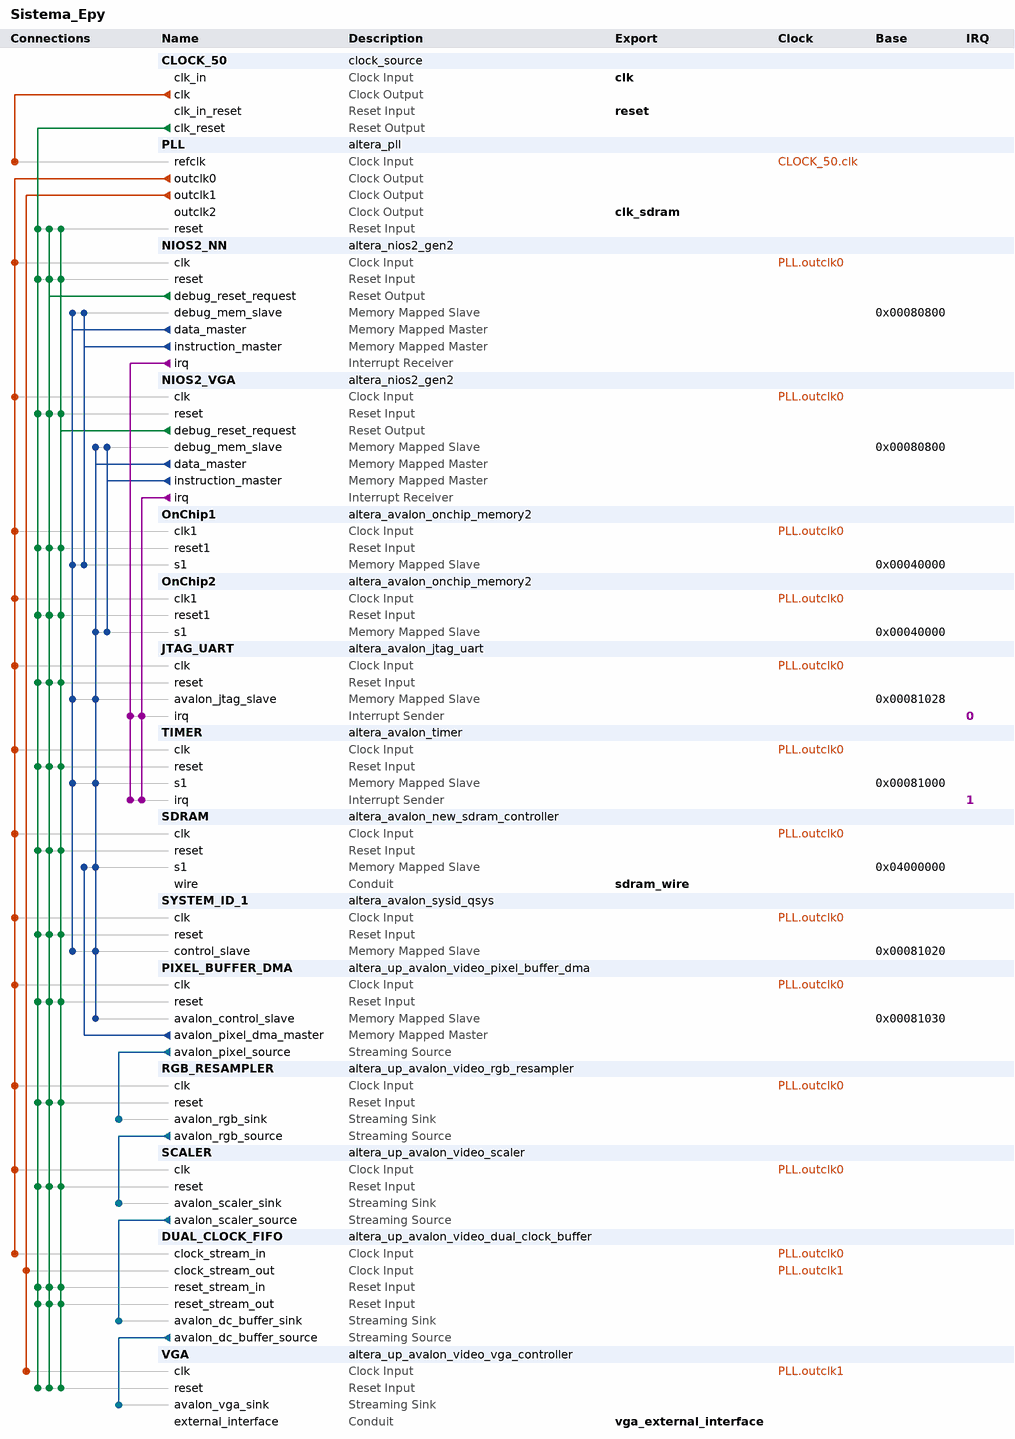
[diagram p0: system contents]
# Platform Designer (Qsys) system Sistema_Epy, Cyclone V 5CSXFC6D6F31C6
# Parameters at their usual value, and those the tool derives, are not listed.
package require -exact qsys 16.1
create_system Sistema_Epy
set_project_property DEVICE_FAMILY {Cyclone V}
set_project_property DEVICE 5CSXFC6D6F31C6

add_instance CLOCK_50 clock_source 16.1
set_instance_parameter_value CLOCK_50 clockFrequency 50000000

add_instance PLL altera_pll 16.1
set_instance_parameter_value PLL gui_device_speed_grade 2
set_instance_parameter_value PLL gui_number_of_clocks 3
set_instance_parameter_value PLL gui_operation_mode direct
set_instance_parameter_value PLL gui_output_clock_frequency0 100.0
set_instance_parameter_value PLL gui_output_clock_frequency1 25.0
set_instance_parameter_value PLL gui_output_clock_frequency2 100.0
set_instance_parameter_value PLL gui_phase_shift2 -3000
set_instance_parameter_value PLL gui_pll_mode {Integer-N PLL}
set_instance_parameter_value PLL gui_reference_clock_frequency 50.0
set_instance_parameter_value PLL gui_use_locked false

add_instance NIOS2_NN altera_nios2_gen2 16.1
set_instance_parameter_value NIOS2_NN dcache_size 2048
set_instance_parameter_value NIOS2_NN exceptionSlave OnChip1.s1
set_instance_parameter_value NIOS2_NN icache_size 4096
set_instance_parameter_value NIOS2_NN impl Tiny
set_instance_parameter_value NIOS2_NN resetSlave OnChip1.s1

add_instance NIOS2_VGA altera_nios2_gen2 16.1
set_instance_parameter_value NIOS2_VGA dcache_size 2048
set_instance_parameter_value NIOS2_VGA exceptionSlave OnChip2.s1
set_instance_parameter_value NIOS2_VGA icache_size 4096
set_instance_parameter_value NIOS2_VGA impl Fast
set_instance_parameter_value NIOS2_VGA resetSlave OnChip2.s1

add_instance OnChip1 altera_avalon_onchip_memory2 16.1
set_instance_parameter_value OnChip1 dataWidth 32
set_instance_parameter_value OnChip1 dualPort false
set_instance_parameter_value OnChip1 initMemContent true
set_instance_parameter_value OnChip1 initializationFileName onchip_mem.hex
set_instance_parameter_value OnChip1 memorySize 240000

add_instance OnChip2 altera_avalon_onchip_memory2 16.1
set_instance_parameter_value OnChip2 dataWidth 32
set_instance_parameter_value OnChip2 dualPort false
set_instance_parameter_value OnChip2 initMemContent true
set_instance_parameter_value OnChip2 initializationFileName onchip_mem.hex
set_instance_parameter_value OnChip2 memorySize 240000

add_instance JTAG_UART altera_avalon_jtag_uart 16.1
set_instance_parameter_value JTAG_UART simInteractiveOptions NO_INTERACTIVE_WINDOWS

add_instance TIMER altera_avalon_timer 16.1
set_instance_parameter_value TIMER period 1
set_instance_parameter_value TIMER periodUnits MSEC

add_instance SDRAM altera_avalon_new_sdram_controller 16.1
set_instance_parameter_value SDRAM TAC 5.5
set_instance_parameter_value SDRAM TRCD 20.0
set_instance_parameter_value SDRAM TRP 20.0
set_instance_parameter_value SDRAM casLatency 3
set_instance_parameter_value SDRAM columnWidth 10
set_instance_parameter_value SDRAM dataWidth 16
set_instance_parameter_value SDRAM generateSimulationModel false
set_instance_parameter_value SDRAM model single_Micron_MT48LC4M32B2_7_chip
set_instance_parameter_value SDRAM numberOfBanks 4
set_instance_parameter_value SDRAM numberOfChipSelects 1
set_instance_parameter_value SDRAM powerUpDelay 100.0
set_instance_parameter_value SDRAM refreshPeriod 15.625
set_instance_parameter_value SDRAM rowWidth 13

add_instance SYSTEM_ID_1 altera_avalon_sysid_qsys 16.1
set_instance_parameter_value SYSTEM_ID_1 id 0

add_instance PIXEL_BUFFER_DMA altera_up_avalon_video_pixel_buffer_dma 16.1
set_instance_parameter_value PIXEL_BUFFER_DMA addr_mode X-Y
set_instance_parameter_value PIXEL_BUFFER_DMA back_start_address 0
set_instance_parameter_value PIXEL_BUFFER_DMA color_space {16-bit RGB}
set_instance_parameter_value PIXEL_BUFFER_DMA image_height 240
set_instance_parameter_value PIXEL_BUFFER_DMA image_width 320
set_instance_parameter_value PIXEL_BUFFER_DMA start_address 0

add_instance RGB_RESAMPLER altera_up_avalon_video_rgb_resampler 16.1
set_instance_parameter_value RGB_RESAMPLER alpha 1023
set_instance_parameter_value RGB_RESAMPLER input_type {16-bit RGB}
set_instance_parameter_value RGB_RESAMPLER output_type {30-bit RGB}

add_instance SCALER altera_up_avalon_video_scaler 16.1
set_instance_parameter_value SCALER color_bits 10
set_instance_parameter_value SCALER color_planes 3
set_instance_parameter_value SCALER height_scaling 2
set_instance_parameter_value SCALER width_in 320
set_instance_parameter_value SCALER width_scaling 2

add_instance DUAL_CLOCK_FIFO altera_up_avalon_video_dual_clock_buffer 16.1
set_instance_parameter_value DUAL_CLOCK_FIFO color_bits 10

add_instance VGA altera_up_avalon_video_vga_controller 16.1
set_instance_parameter_value VGA board DE1-SoC
set_instance_parameter_value VGA resolution {VGA 640x480}

# connections
add_connection CLOCK_50.clk PLL.refclk clock
add_connection PLL.outclk0 DUAL_CLOCK_FIFO.clock_stream_in clock
add_connection PLL.outclk0 JTAG_UART.clk clock
add_connection PLL.outclk0 NIOS2_NN.clk clock
add_connection PLL.outclk0 NIOS2_VGA.clk clock
add_connection PLL.outclk0 OnChip1.clk1 clock
add_connection PLL.outclk0 OnChip2.clk1 clock
add_connection PLL.outclk0 PIXEL_BUFFER_DMA.clk clock
add_connection PLL.outclk0 RGB_RESAMPLER.clk clock
add_connection PLL.outclk0 SCALER.clk clock
add_connection PLL.outclk0 SDRAM.clk clock
add_connection PLL.outclk0 SYSTEM_ID_1.clk clock
add_connection PLL.outclk0 TIMER.clk clock
add_connection PLL.outclk1 DUAL_CLOCK_FIFO.clock_stream_out clock
add_connection PLL.outclk1 VGA.clk clock
add_connection CLOCK_50.clk_reset DUAL_CLOCK_FIFO.reset_stream_in reset
add_connection CLOCK_50.clk_reset DUAL_CLOCK_FIFO.reset_stream_out reset
add_connection CLOCK_50.clk_reset JTAG_UART.reset reset
add_connection CLOCK_50.clk_reset NIOS2_NN.reset reset
add_connection CLOCK_50.clk_reset NIOS2_VGA.reset reset
add_connection CLOCK_50.clk_reset OnChip1.reset1 reset
add_connection CLOCK_50.clk_reset OnChip2.reset1 reset
add_connection CLOCK_50.clk_reset PIXEL_BUFFER_DMA.reset reset
add_connection CLOCK_50.clk_reset PLL.reset reset
add_connection CLOCK_50.clk_reset RGB_RESAMPLER.reset reset
add_connection CLOCK_50.clk_reset SCALER.reset reset
add_connection CLOCK_50.clk_reset SDRAM.reset reset
add_connection CLOCK_50.clk_reset SYSTEM_ID_1.reset reset
add_connection CLOCK_50.clk_reset TIMER.reset reset
add_connection CLOCK_50.clk_reset VGA.reset reset
add_connection NIOS2_NN.debug_reset_request DUAL_CLOCK_FIFO.reset_stream_in reset
add_connection NIOS2_NN.debug_reset_request DUAL_CLOCK_FIFO.reset_stream_out reset
add_connection NIOS2_NN.debug_reset_request JTAG_UART.reset reset
add_connection NIOS2_NN.debug_reset_request NIOS2_NN.reset reset
add_connection NIOS2_NN.debug_reset_request NIOS2_VGA.reset reset
add_connection NIOS2_NN.debug_reset_request OnChip1.reset1 reset
add_connection NIOS2_NN.debug_reset_request OnChip2.reset1 reset
add_connection NIOS2_NN.debug_reset_request PIXEL_BUFFER_DMA.reset reset
add_connection NIOS2_NN.debug_reset_request PLL.reset reset
add_connection NIOS2_NN.debug_reset_request RGB_RESAMPLER.reset reset
add_connection NIOS2_NN.debug_reset_request SCALER.reset reset
add_connection NIOS2_NN.debug_reset_request SDRAM.reset reset
add_connection NIOS2_NN.debug_reset_request SYSTEM_ID_1.reset reset
add_connection NIOS2_NN.debug_reset_request TIMER.reset reset
add_connection NIOS2_NN.debug_reset_request VGA.reset reset
add_connection NIOS2_VGA.debug_reset_request DUAL_CLOCK_FIFO.reset_stream_in reset
add_connection NIOS2_VGA.debug_reset_request DUAL_CLOCK_FIFO.reset_stream_out reset
add_connection NIOS2_VGA.debug_reset_request JTAG_UART.reset reset
add_connection NIOS2_VGA.debug_reset_request NIOS2_NN.reset reset
add_connection NIOS2_VGA.debug_reset_request NIOS2_VGA.reset reset
add_connection NIOS2_VGA.debug_reset_request OnChip1.reset1 reset
add_connection NIOS2_VGA.debug_reset_request OnChip2.reset1 reset
add_connection NIOS2_VGA.debug_reset_request PIXEL_BUFFER_DMA.reset reset
add_connection NIOS2_VGA.debug_reset_request PLL.reset reset
add_connection NIOS2_VGA.debug_reset_request RGB_RESAMPLER.reset reset
add_connection NIOS2_VGA.debug_reset_request SCALER.reset reset
add_connection NIOS2_VGA.debug_reset_request SDRAM.reset reset
add_connection NIOS2_VGA.debug_reset_request SYSTEM_ID_1.reset reset
add_connection NIOS2_VGA.debug_reset_request TIMER.reset reset
add_connection NIOS2_VGA.debug_reset_request VGA.reset reset
add_connection NIOS2_NN.data_master JTAG_UART.avalon_jtag_slave avalon
set_connection_parameter_value NIOS2_NN.data_master/JTAG_UART.avalon_jtag_slave baseAddress 0x00081028
add_connection NIOS2_NN.data_master NIOS2_NN.debug_mem_slave avalon
set_connection_parameter_value NIOS2_NN.data_master/NIOS2_NN.debug_mem_slave baseAddress 0x00080800
add_connection NIOS2_NN.data_master OnChip1.s1 avalon
set_connection_parameter_value NIOS2_NN.data_master/OnChip1.s1 baseAddress 0x00040000
add_connection NIOS2_NN.data_master SYSTEM_ID_1.control_slave avalon
set_connection_parameter_value NIOS2_NN.data_master/SYSTEM_ID_1.control_slave baseAddress 0x00081020
add_connection NIOS2_NN.data_master TIMER.s1 avalon
set_connection_parameter_value NIOS2_NN.data_master/TIMER.s1 baseAddress 0x00081000
add_connection NIOS2_NN.instruction_master NIOS2_NN.debug_mem_slave avalon
set_connection_parameter_value NIOS2_NN.instruction_master/NIOS2_NN.debug_mem_slave baseAddress 0x00080800
add_connection NIOS2_NN.instruction_master OnChip1.s1 avalon
set_connection_parameter_value NIOS2_NN.instruction_master/OnChip1.s1 baseAddress 0x00040000
add_connection NIOS2_VGA.data_master JTAG_UART.avalon_jtag_slave avalon
set_connection_parameter_value NIOS2_VGA.data_master/JTAG_UART.avalon_jtag_slave baseAddress 0x00081028
add_connection NIOS2_VGA.data_master NIOS2_VGA.debug_mem_slave avalon
set_connection_parameter_value NIOS2_VGA.data_master/NIOS2_VGA.debug_mem_slave baseAddress 0x00080800
add_connection NIOS2_VGA.data_master OnChip2.s1 avalon
set_connection_parameter_value NIOS2_VGA.data_master/OnChip2.s1 baseAddress 0x00040000
add_connection NIOS2_VGA.data_master PIXEL_BUFFER_DMA.avalon_control_slave avalon
set_connection_parameter_value NIOS2_VGA.data_master/PIXEL_BUFFER_DMA.avalon_control_slave baseAddress 0x00081030
add_connection NIOS2_VGA.data_master SDRAM.s1 avalon
set_connection_parameter_value NIOS2_VGA.data_master/SDRAM.s1 baseAddress 0x04000000
add_connection NIOS2_VGA.data_master SYSTEM_ID_1.control_slave avalon
set_connection_parameter_value NIOS2_VGA.data_master/SYSTEM_ID_1.control_slave baseAddress 0x00081020
add_connection NIOS2_VGA.data_master TIMER.s1 avalon
set_connection_parameter_value NIOS2_VGA.data_master/TIMER.s1 baseAddress 0x00081000
add_connection NIOS2_VGA.instruction_master NIOS2_VGA.debug_mem_slave avalon
set_connection_parameter_value NIOS2_VGA.instruction_master/NIOS2_VGA.debug_mem_slave baseAddress 0x00080800
add_connection NIOS2_VGA.instruction_master OnChip2.s1 avalon
set_connection_parameter_value NIOS2_VGA.instruction_master/OnChip2.s1 baseAddress 0x00040000
add_connection PIXEL_BUFFER_DMA.avalon_pixel_dma_master SDRAM.s1 avalon
set_connection_parameter_value PIXEL_BUFFER_DMA.avalon_pixel_dma_master/SDRAM.s1 baseAddress 0x04000000
add_connection DUAL_CLOCK_FIFO.avalon_dc_buffer_source VGA.avalon_vga_sink avalon_streaming
add_connection PIXEL_BUFFER_DMA.avalon_pixel_source RGB_RESAMPLER.avalon_rgb_sink avalon_streaming
add_connection RGB_RESAMPLER.avalon_rgb_source SCALER.avalon_scaler_sink avalon_streaming
add_connection SCALER.avalon_scaler_source DUAL_CLOCK_FIFO.avalon_dc_buffer_sink avalon_streaming
add_connection NIOS2_NN.irq JTAG_UART.irq interrupt
set_connection_parameter_value NIOS2_NN.irq/JTAG_UART.irq irqNumber 0
add_connection NIOS2_NN.irq TIMER.irq interrupt
set_connection_parameter_value NIOS2_NN.irq/TIMER.irq irqNumber 1
add_connection NIOS2_VGA.irq JTAG_UART.irq interrupt
set_connection_parameter_value NIOS2_VGA.irq/JTAG_UART.irq irqNumber 0
add_connection NIOS2_VGA.irq TIMER.irq interrupt
set_connection_parameter_value NIOS2_VGA.irq/TIMER.irq irqNumber 1

# exported interfaces
add_interface clk clock sink
set_interface_property clk EXPORT_OF CLOCK_50.clk_in
add_interface clk_sdram clock source
set_interface_property clk_sdram EXPORT_OF PLL.outclk2
add_interface reset reset sink
set_interface_property reset EXPORT_OF CLOCK_50.clk_in_reset
add_interface sdram_wire conduit end
set_interface_property sdram_wire EXPORT_OF SDRAM.wire
add_interface vga_external_interface conduit end
set_interface_property vga_external_interface EXPORT_OF VGA.external_interface

set_interconnect_requirement {$system} qsys_mm.clockCrossingAdapter HANDSHAKE
set_interconnect_requirement {$system} qsys_mm.enableEccProtection FALSE
set_interconnect_requirement {$system} qsys_mm.insertDefaultSlave FALSE
set_interconnect_requirement {$system} qsys_mm.maxAdditionalLatency 1

save_system Sistema_Epy.qsys
